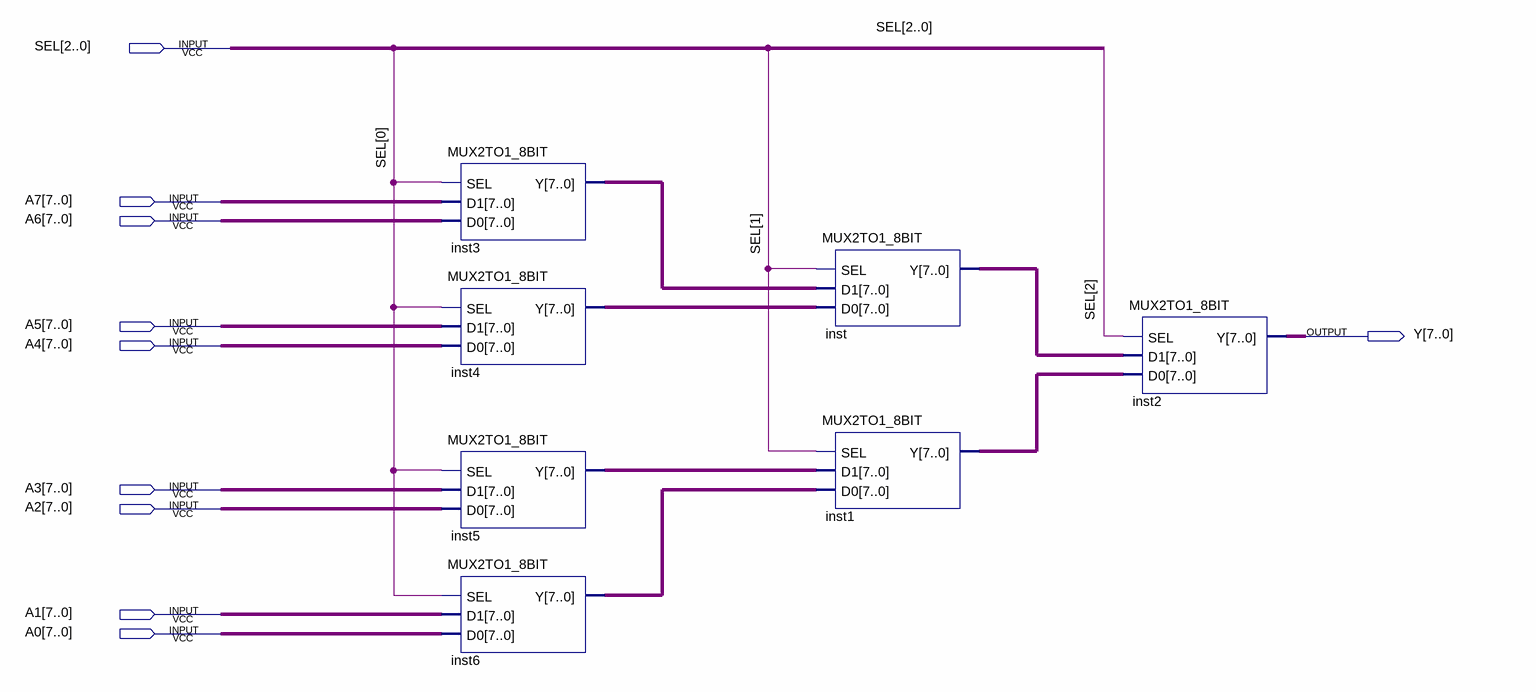
[diagram p0: schematic sheet]
// Quartus schematic MUX8TO1_8BIT.bdf as structural Verilog: 7 symbols, 10 pins
module MUX8TO1_8BIT (
  input  [2:0] SEL,
  input  [7:0] A7,
  input  [7:0] A6,
  input  [7:0] A5,
  input  [7:0] A4,
  input  [7:0] A3,
  input  [7:0] A2,
  input  [7:0] A1,
  input  [7:0] A0,
  output [7:0] Y
);

  wire [7:0] inst1_y, inst3_y, inst4_y, inst5_y, inst6_y, inst_y;

  MUX2TO1_8BIT inst3 (.SEL(SEL[0]), .D1(A7), .D0(A6), .Y(inst3_y));
  MUX2TO1_8BIT inst4 (.SEL(SEL[0]), .D1(A5), .D0(A4), .Y(inst4_y));
  MUX2TO1_8BIT inst5 (.SEL(SEL[0]), .D1(A3), .D0(A2), .Y(inst5_y));
  MUX2TO1_8BIT inst6 (.SEL(SEL[0]), .D1(A1), .D0(A0), .Y(inst6_y));
  MUX2TO1_8BIT inst (.SEL(SEL[1]), .D1(inst3_y), .D0(inst4_y), .Y(inst_y));
  MUX2TO1_8BIT inst1 (.SEL(SEL[1]), .D1(inst5_y), .D0(inst6_y), .Y(inst1_y));
  MUX2TO1_8BIT inst2 (.SEL(SEL[2]), .D1(inst_y), .D0(inst1_y), .Y(Y));
endmodule
